# Altium schematic sheet Sns.SchDoc
size A4
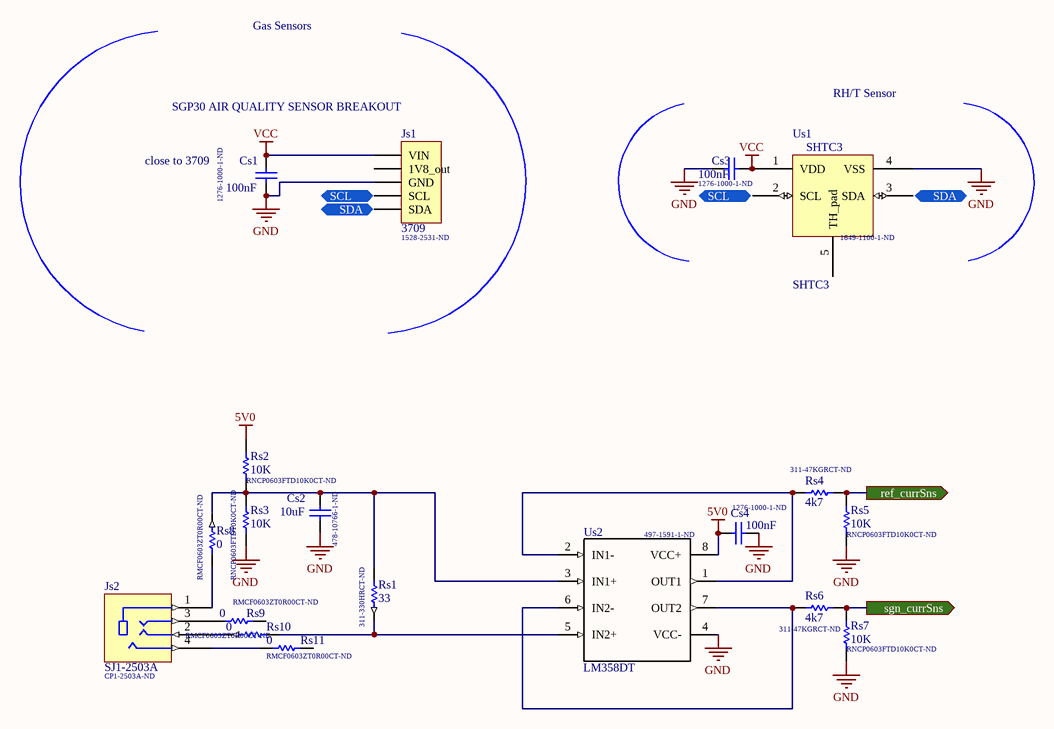
[diagram p0: Sns.SchDoc]

## Parts
Cs1  value 100nF  Supplier Part Number 1: 1276-1000-1-ND  [c0603]  (hidden comment: Cap)
Cs2  value 10uF  Supplier Part Number 1: 478-10766-1-ND  [c0603]  (hidden comment: Cap)
Cs3  value 100nF  Supplier Part Number 1: 1276-1000-1-ND  [c0603]  (hidden comment: Cap)
Cs4  value 100nF  Supplier Part Number 1: 1276-1000-1-ND  [c0603]  (hidden comment: Cap)
Js1  3709  Supplier Part Number 1: 1528-2531-ND  [Adafruit_SGP30_board]
Js2  SJ1-2503A  Supplier Part Number 1: CP1-2503A-ND  [JACK3.5_4DIP_1ancor]
Rs1  value 33  Supplier Part Number 1: 311-330HRCT-ND  [r0603]  (hidden comment: Res1)
Rs2  value 10K  Supplier Part Number 1: RNCP0603FTD10K0CT-ND  [r0603]  (hidden comment: Res1)
Rs3  value 10K  Supplier Part Number 1: RNCP0603FTD10K0CT-ND  [r0603]  (hidden comment: Res1)
Rs4  value 4k7  Supplier Part Number 1: 311-47KGRCT-ND  [r0603]  (hidden comment: Res1)
Rs5  value 10K  Supplier Part Number 1: RNCP0603FTD10K0CT-ND  [r0603]  (hidden comment: Res1)
Rs6  value 4k7  Supplier Part Number 1: 311-47KGRCT-ND  [r0603]  (hidden comment: Res1)
Rs7  value 10K  Supplier Part Number 1: RNCP0603FTD10K0CT-ND  [r0603]  (hidden comment: Res1)
Rs8  value 0  Supplier Part Number 1: RMCF0603ZT0R00CT-ND  [r0603]  (hidden comment: Res1)
Rs9  value 0  Supplier Part Number 1: RMCF0603ZT0R00CT-ND  [r0603]  (hidden comment: Res1)
Rs10  value 0  Supplier Part Number 1: RMCF0603ZT0R00CT-ND  [r0603]  (hidden comment: Res1)
Rs11  value 0  Supplier Part Number 1: RMCF0603ZT0R00CT-ND  [r0603]  (hidden comment: Res1)
Us1  SHTC3  Supplier Part Number 1: 1649-1100-1-ND  [DFN-4]
Us2  LM358DT  Supplier Part Number 1: 497-1591-1-ND  [SO8]

## Ports
ref_currSns (out), SCL (bidir), SDA (bidir), sgn_currSns (out)

## Nets
5V0: Cs4.2 Rs2.1 Us2.8(VCC+)
GND: Cs1.1 Cs2.1 Cs3.2 Cs4.1 Js1.3(GND) Rs3.2 Rs5.2 Rs7.2 Us1.4(VSS) Us2.4(VCC-)
VCC: Cs1.2 Cs3.1 Js1.1(VIN) Us1.1(VDD)
ref_currSns: Rs4.2 Rs5.1 ; port ref_currSns
SCL: Js1.4(SCL) Us1.2(SCL) ; port SCL
SDA: Js1.5(SDA) Us1.3(SDA) ; port SDA
sgn_currSns: Rs6.2 Rs7.1 ; port sgn_currSns
NetCs2_2: Cs2.2 Rs1.1 Rs2.2 Rs3.1 Rs8.1 Us2.3(IN1+)
NetJs2_1: Js2.1 Rs8.2
NetJs2_2: Js2.2 Rs10.1
NetJs2_3: Js2.3 Rs9.1
NetJs2_4: Js2.4 Rs11.1
NetRs1_2: Rs1.2 Rs10.2 Us2.5(IN2+)
NetRs4_1: Rs4.1 Us2.1(OUT1) Us2.2(IN1-)
NetRs6_1: Rs6.1 Us2.6(IN2-) Us2.7(OUT2)

Not connected (* = marked no-connect by the designer): Js1 2(1V8_out); Rs9 2; Rs11 2; Us1 5(TH_pad)

## Notes on the sheet
- Gas Sensors
- SGP30 AIR QUALITY SENSOR BREAKOUT
- RH/T Sensor
- (near Cs1) close to 3709

## Library data of the parts
Cs1-Cs4 = Cap: Capacitor; Published: 8-Jun-2000; LatestRevisionDate: 17-Jul-2002; LatestRevisionNote: Re-released for DXP Platform.; PackageReference: RAD-0.3; Publisher: Altium Limited; PackageDescription: Radial Cap, Thru-Hole; 2 Leads; 0.3 in Pin Spacing; Supplier 1: Digi-Key
Js1 = Header 5: Header, 5-Pin; LatestRevisionDate: 17-Jul-2002; LatestRevisionNote: Re-released for DXP Platform.; Publisher: Altium Limited; ComponentLink1Description: VOC concentration; ComponentLink1URL: https://www.sensirion.com/fileadmin/user_upload/customers/sensirion/Dokumente/9_Gas_Sensors/Sensirion_Gas_Sensors_SGP3x_TVOC_Concept.pdf; Supplier 1: Digi-Key
Js2 = jack3.5_ SJ1-2503A: Supplier 1: Digi-Key
Rs1-Rs11 = Res1: Resistor; Published: 8-Jun-2000; LatestRevisionDate: 17-Jul-2002; LatestRevisionNote: Re-released for DXP Platform.; PackageReference: AXIAL-0.3; Publisher: Altium Limited; PackageDescription: Axial Device, Thru-Hole; 2 Leads; 0.3 in Pin Spacing; Supplier 1: Digi-Key
Us1 = SHTC3: Humidity and Temperature Sensor IC: - Ultra-low power consumption / - Full battery supply voltage range (1.62 - 3.6 V) / - Small DFN package: 2 × 2 × 0.75 mm3 / - Typical accuracy: ±2 %RH and ±0.2 °C / - Fully calibrated and reflow solderable / - Power-up and measurement within 1 ms; ComponentLink1Description: datasheet; ComponentLink1URL: https://www.sensirion.com/fileadmin/user_upload/customers/sensirion/Dokumente/0_Datasheets/Humidity/Sensirion_Humidity_Sensors_SHTC3_Datasheet.pdf; Supplier 1: Digi-Key
Us2 = LM358DT: LM358 Series 30 V 1.1 MHz Low Power Dual Operational Amplifier - SOIC-8; MF: STMicroelectronics; Price: None; Availability: Unavailable; Package: SOIC-8 STMicroelectronics; MP: LM358DT; SnapEDA_Link: https://www.snapeda.com/parts/LM358DT/STMicroelectronics/view-part/?ref=snap; Value: *; Supplier 1: Digi-Key